# EAGLE schematic introAu (EAGLE 7.3.0)
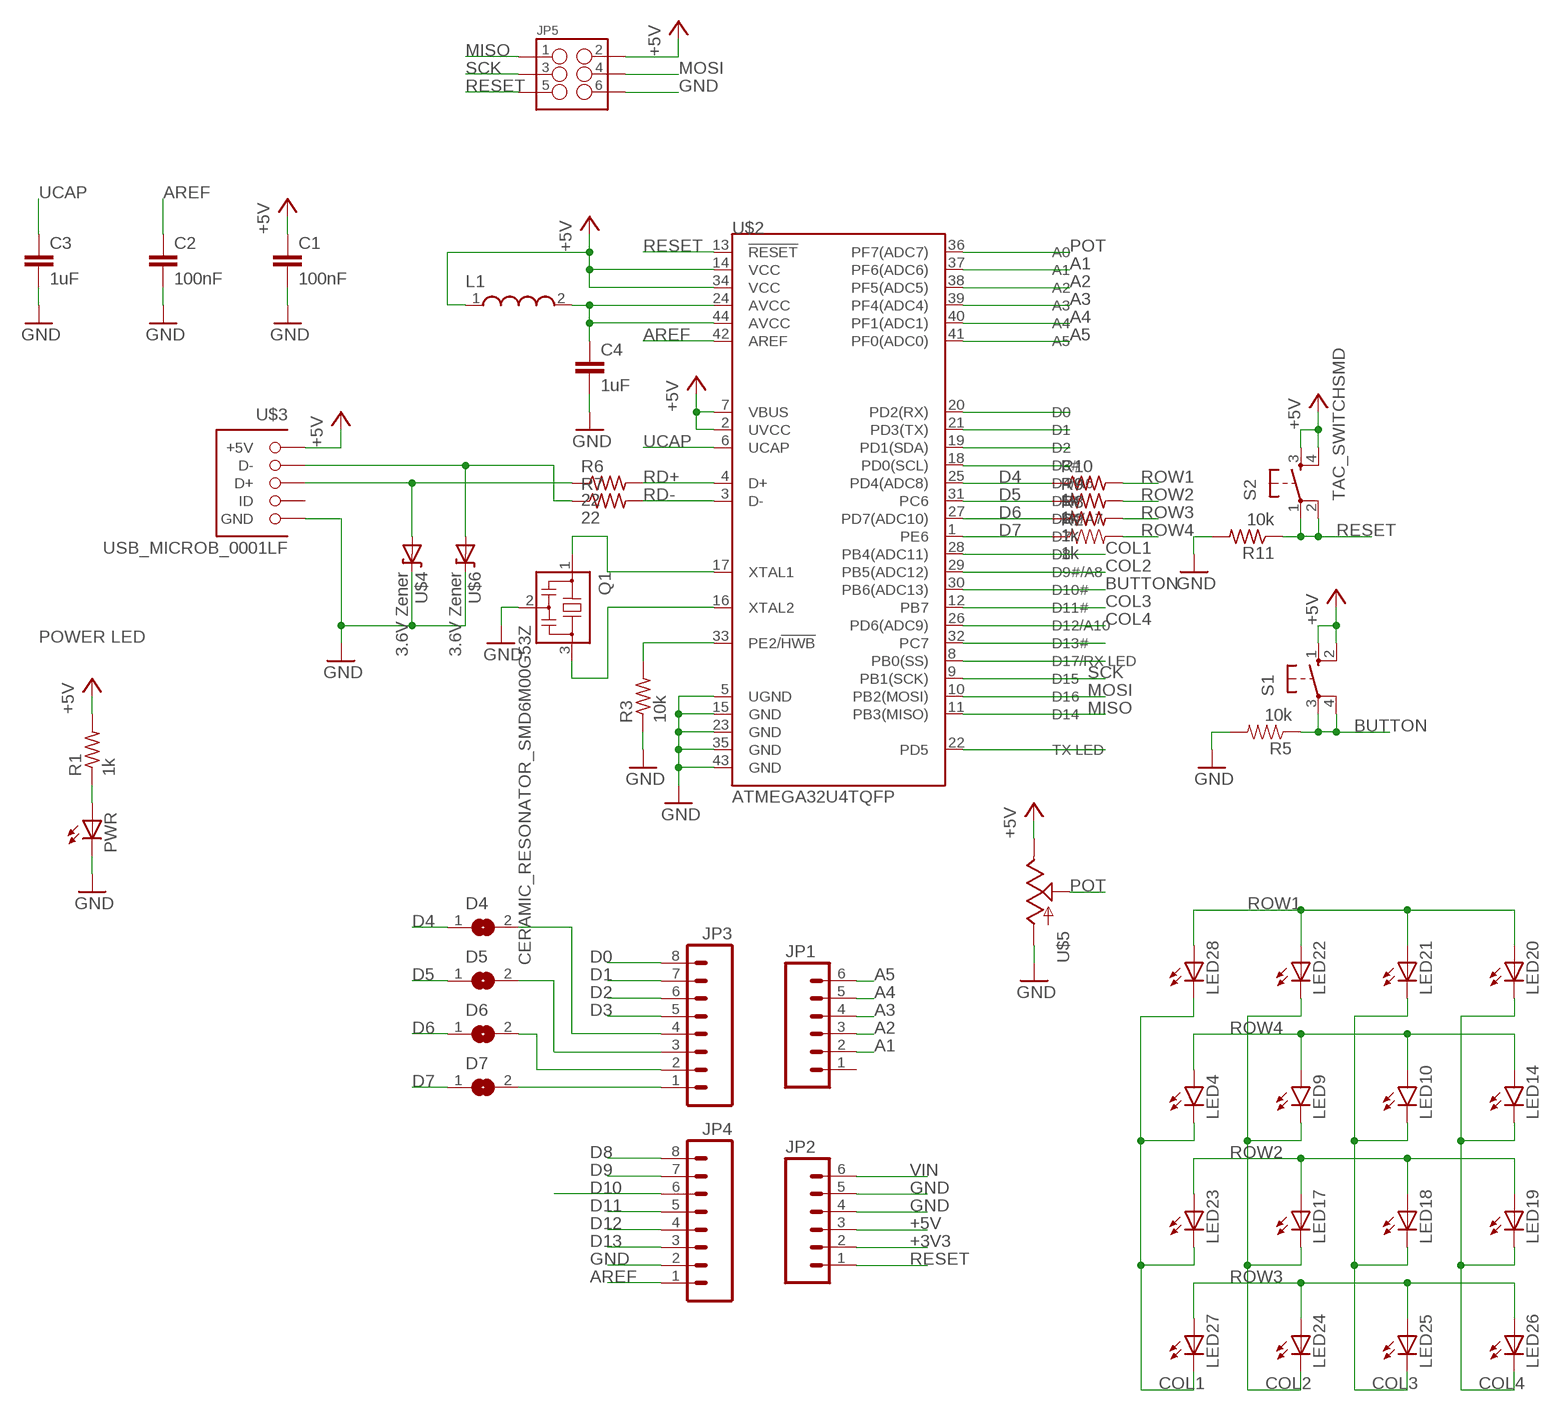
[diagram p0: schematic, sheet 1]

## Parts
C1  100nF  C-EUC0805  [C0805]
C2  100nF  C-EUC0805  [C0805]
C3  1uF  C-EUC0805  [C0805]
C4  1uF  C-EUC0805  [C0805]
D4  SJ  [SJ]
D5  SJ  [SJ]
D6  SJ  [SJ]
D7  SJ  [SJ]
JP1  M06SMD-STRAIGHT-COMBO  [1X06_SMD_STRAIGHT_COMBO]
JP2  M06SMD-STRAIGHT-COMBO  [1X06_SMD_STRAIGHT_COMBO]
JP3  M08SMD-COMBO  [1X08_SMD_COMBINED]
JP4  M08SMD-COMBO  [1X08_SMD_COMBINED]
JP5  M03X22X3_SILK_SM  [2X3]
L1  WE-CBF_0805(WB/HS)  [WE-CBF_0805(W=3.0)]
LED4  LED5MM  [LED5MM]
LED9  LED5MM  [LED5MM]
LED10  LED5MM  [LED5MM]
LED14  LED5MM  [LED5MM]
LED17  LEDCHIPLED_0805  [CHIPLED_0805]
LED18  LEDCHIPLED_0805  [CHIPLED_0805]
LED19  LEDCHIPLED_0805  [CHIPLED_0805]
LED20  LEDCHIPLED_0805  [CHIPLED_0805]
LED21  LEDCHIPLED_0805  [CHIPLED_0805]
LED22  LEDCHIPLED_0805  [CHIPLED_0805]
LED23  LEDCHIPLED_0805  [CHIPLED_0805]
LED24  LEDCHIPLED_0805  [CHIPLED_0805]
LED25  LEDCHIPLED_0805  [CHIPLED_0805]
LED26  LEDCHIPLED_0805  [CHIPLED_0805]
LED27  LEDCHIPLED_0805  [CHIPLED_0805]
LED28  LEDCHIPLED_0805  [CHIPLED_0805]
PWR  LEDCHIPLED_0805  [CHIPLED_0805]
Q1  CERAMIC_RESONATOR_SMD6M00G53Z  [CERAMIC_RESONATOR_SMD]
R1  1k  R-US_R0805  [R0805]
R2  1k  1KOHM1/4W5%(PTH)HORIZ-KIT  [AXIAL-0.3EZ]
R3  10k  R-US_R0805  [R0805]
R5  10k  1KOHM1/4W5%(PTH)HORIZ-KIT  [AXIAL-0.3EZ]
R6  22  R-US_R0805  [R0805]
R7  22  R-US_R0805  [R0805]
R8  1k  R-US_R0805  [R0805]
R9  1k  R-US_R0805  [R0805]
R10  1k  R-US_R0805  [R0805]
R11  10k  R-US_R0805  [R0805]
S1  TACT_BUTTON  [B3F-10XX]
S2  TAC_SWITCHSMD  [TACTILE-SWITCH-SMD]
U$2  ATMEGA32U4TQFP  [SPARKFUN-DIGITALIC_TQFP44]
U$3  USB_MICROB_0001LF  [USB_MICROB_CHEAPER]
U$4  3.6V Zener  DIODE-ZENER-BZT52  [SOD-323]
U$5  POT  [ALPS_POT]
U$6  3.6V Zener  DIODE-ZENER-BZT52  [SOD-323]

## Nets
+3V3: JP2.2
+5V: C1.1 JP2.3 JP5.2 L1.1 R1.2 S1.1(S) S1.2(S1) S2.3 S2.4 U$2.2(UVCC) U$2.7(VBUS) U$2.14(VCC) U$2.34(VCC) U$3.P$1(+5V) U$5.P$1(E)
A1: JP1.2 U$2.37(PF6(ADC6))
A2: JP1.3 U$2.38(PF5(ADC5))
A3: JP1.4 U$2.39(PF4(ADC4))
A4: JP1.5 U$2.40(PF1(ADC1))
A5: JP1.6 U$2.41(PF0(ADC0))
AREF: C2.1 JP4.1 U$2.42(AREF)
BUTTON: R5.P$1 S1.3(P) S1.4(P1) U$2.30(PB6(ADC13))
COL1: LED4.K(C) LED23.C LED27.C LED28.C U$2.28(PB4(ADC11))
COL2: LED9.K(C) LED17.C LED22.C LED24.C U$2.29(PB5(ADC12))
COL3: LED10.K(C) LED18.C LED21.C LED25.C U$2.12(PB7)
COL4: LED14.K(C) LED19.C LED20.C LED26.C U$2.26(PD6(ADC9))
D0: JP3.8 U$2.20(PD2(RX))
D1: JP3.7 U$2.21(PD3(TX))
D2: JP3.6 U$2.19(PD1(SDA))
D3: JP3.5 U$2.18(PD0(SCL))
D4: D4.1 R10.1 U$2.25(PD4(ADC8))
D5: D5.1 R9.1 U$2.31(PC6)
D6: D6.1 R8.1 U$2.27(PD7(ADC10))
D7: D7.1 R2.P$1 U$2.1(PE6)
D8: JP4.8
D9: JP4.7
D10: JP4.6
D11: JP4.5
D12: JP4.4
D13: JP4.3 U$2.32(PC7)
D17: U$2.8(PB0(SS))
GND: C1.2 C2.2 C3.2 C4.2 JP2.4 JP2.5 JP4.2 JP5.6 PWR.C Q1.2 R3.1 R5.P$2 R11.2 U$2.5(UGND) U$2.15(GND) U$2.23(GND) U$2.35(GND) U$2.43(GND) U$3.P$4(GND) U$4.1(C) U$5.P$3(A) U$6.1(C)
MISO: JP5.1 U$2.11(PB3(MISO))
MOSI: JP5.4 U$2.10(PB2(MOSI))
N$5: Q1.3 U$2.16(XTAL2)
N$6: Q1.1 U$2.17(XTAL1)
N$7: R7.1 U$3.P$2(D-) U$6.2(A)
N$8: R3.2 U$2.33(PE2/!HWB)
N$9: R6.1 U$3.P$3(D+) U$4.2(A)
N$10: C4.1 L1.2 U$2.24(AVCC) U$2.44(AVCC)
N$11: PWR.A R1.1
N$12: D7.2 JP3.1
N$15: D5.2 JP3.3
N$16: D6.2 JP3.2
N$17: D4.2 JP3.4
POT: U$2.36(PF7(ADC7)) U$5.P$2(S)
RD+: R6.2 U$2.4(D+)
RD-: R7.2 U$2.3(D-)
RESET: JP2.1 JP5.5 R11.1 S2.1 S2.2 U$2.13(!RESET)
ROW1: LED20.A LED21.A LED22.A LED28.A R10.2
ROW2: LED17.A LED18.A LED19.A LED23.A R9.2
ROW3: LED24.A LED25.A LED26.A LED27.A R8.2
ROW4: LED4.A LED9.A LED10.A LED14.A R2.P$2
SCK: JP5.3 U$2.9(PB1(SCK))
TX: U$2.22(PD5)
UCAP: C3.1 U$2.6(UCAP)
VIN: JP2.6
Unconnected: JP1.1 U$3.P$5(ID)

## Notes on the sheet
- POWER LED

## Library data of the parts
C1-C4 = rcl:C-EU: CAPACITOR, European symbol
D4-D7 = jumper:SJ: SMD solder JUMPER
JP1 JP2 = SparkFun-Connectors:M06: Header 6 Standard 6-pin 0.1" header. Use with straight break away headers (SKU : PRT-00116), right angle break away headers (PRT-00553), swiss pins (PRT-00743), machine pins (PRT-00117), and female headers (PRT-00115). Molex polarized connector foot print use with SKU : PRT-08094 with associated crimp pins and housings. NOTES ON THE VARIANTS LOCK and LOCK_LONGPADS... This footprint was designed to help hold the alignment of a through-hole component (i.e. 6-pin header) while soldering it into place. You may notice that each hole has been shifted either up or down by 0.005 of an inch from it's more standard position (which is a perfectly straight line). This slight alteration caused the pins (the squares in the middle) to touch the edges of the holes. Because they are alternating, it causes a "brace" to hold the component in place. 0.005 has proven to be the perfect amount of "off-center" position when using our standard breakaway headers. Although looks a little odd when you look at the bare footprint, once you have a header in there, the alteration is very hard to notice. Also,if you push a header all the way into place, it is covered up entirely on the bottom side. This idea of altering the position of holes to aid alignment will be further integrated into the Sparkfun Library for other footprints. It can help hold any component with 3 or more connection pins.
JP3 JP4 = SparkFun-Connectors:M08: Header 8 Standard 8-pin 0.1" header. Use with straight break away headers (SKU : PRT-00116), right angle break away headers (PRT-00553), swiss pins (PRT-00743), machine pins (PRT-00117), and female headers (PRT-00115).
JP5 = SparkFun-Connectors:M03X2: 2x3 .1" header. Shrouded, with keying- CONN-10681 SMT- CONN-11415 Pogo pins- HW-11044
L1 = EagleLibrary_Wuerth_Elektronik_eiSos_rev15c:WE-CBF: WE-CBF SMD EMI Suppression Ferrite Bead Characteristics Reliable Ni-Sn electrodes High rated current up to 6 A Operating temperature: –55 ºC to +125 ºC Applications Perfect as data lined filter and for uncoupling of distribution voltage Variant abbreviation WB means WIDE BAND HS means HIGH SPEED HC means HIGH CURRENT <http://katalog.we-online.de/media/images/eisos/FeCBF_pf2.jpg> Details see: http://katalog.we-online.de/en/pbs/WE-CBF Updated on 2014-06-19 2014 (C) Wurth Elektronik
LED4 LED9 LED10 LED14 = SparkFun-LED:LED: LEDs Standard schematic elements and footprints for 5mm, 3mm, 1206, and 0603 sized LEDs. 5mm - Spark Fun Electronics SKU : COM-00529 (and others)
LED17-LED28 PWR = led:LED: LED OSRAM: - CHIPLED LG R971, LG N971, LY N971, LG Q971, LY Q971, LO R971, LY R971 LH N974, LH R974 LS Q976, LO Q976, LY Q976 LO Q996 - Hyper CHIPLED LW Q18S LB Q993, LB Q99A, LB R99A - SideLED LS A670, LO A670, LY A670, LG A670, LP A670 LB A673, LV A673, LT A673, LW A673 LH A674 LY A675 LS A676, LA A676, LO A676, LY A676, LW A676 LS A679, LY A679, LG A679 - Hyper Micro SIDELED® LS Y876, LA Y876, LO Y876, LY Y876 LT Y87S - SmartLED LW L88C, LW L88S LB L89C, LB L89S, LG L890 LS L89K, LO L89K, LY L89K LS L896, LA L896, LO L896, LY L896 - TOPLED LS T670, LO T670, LY T670, LG T670, LP T670 LSG T670, LSP T670, LSY T670, LOP T670, LYG T670 LG T671, LOG T671, LSG T671 LB T673, LV T673, LT T673, LW T673 LH T674 LS T676, LA T676, LO T676, LY T676, LB T676, LH T676, LSB T676, LW T676 LB T67C, LV T67C, LT T67C, LS T67K, LO T67K, LY T67K, LW E67C LS E67B, LA E67B, LO E67B, LY E67B, LB E67C, LV E67C, LT E67C LW T67C LS T679, LY T679, LG T679 LS T770, LO T770, LY T770, LG T770, LP T770 LB T773, LV T773, LT T773, LW T773 LH T774 LS E675, LA E675, LY E675, LS T675 LS T776, LA T776, LO T776, LY T776, LB T776 LHGB T686 LT T68C, LB T68C - Hyper Mini TOPLED® LB M676 - Mini TOPLED Santana® LG M470 LS M47K, LO M47K, LY M47K Source: http://www.osram.convergy.de LUXEON: - LUMILED® LXK2-PW12-R00, LXK2-PW12-S00, LXK2-PW14-U00, LXK2-PW14-V00 LXK2-PM12-R00, LXK2-PM12-S00, LXK2-PM14-U00 LXK2-PE12-Q00, LXK2-PE12-R00, LXK2-PE12-S00, LXK2-PE14-T00, LXK2-PE14-U00 LXK2-PB12-K00, LXK2-PB12-L00, LXK2-PB12-M00, LXK2-PB14-N00, LXK2-PB14-P00, LXK2-PB14-Q00 LXK2-PR12-L00, LXK2-PR12-M00, LXK2-PR14-Q00, LXK2-PR14-R00 LXK2-PD12-Q00, LXK2-PD12-R00, LXK2-PD12-S00 LXK2-PH12-R00, LXK2-PH12-S00 LXK2-PL12-P00, LXK2-PL12-Q00, LXK2-PL12-R00 Source: www.luxeon.com KINGBRIGHT: KA-3528ASYC Source: www.kingbright.com
Q1 = MESH_Arduino:CERAMIC_RESONATOR_SMD: Resonator Source: murata.co.jp; MPN: CSTCR6M00G53-R0; OC_FARNELL: 1170434; OC_NEWARK: 25M8759
R1 R3 R6-R11 = rcl:R-US_: RESISTOR, American symbol
R2 = SparkFun-Resistors:1KOHM1/4W5%(PTH): RES-08380; PROD_ID: RES-08380
R5 = SparkFun-Resistors:1KOHM1/4W5%(PTH): RES-08380; PROD_ID: RES-08380; VALUE: 1k
S1 = MESH_Arduino:TACT_BUTTON: OMRON SWITCH; MPN: B3F-1000; OC_FARNELL: 176432; OC_NEWARK: 36M3542
S2 = mBLE:TAC_SWITCH: Momentary Switch Button commonly used for reset or general input. Spark Fun Electronics SKU : COM-00097 SMT- SWCH-08247; PROD_ID: SWCH-08247
U$2 = SparkFun-DigitalIC:ATMEGA32U4: Atmel 44-pin 8-bit Microcontroller with 32KBytes of ISP Flash and USB Controller ----- Please use the QFN-44-NOPAD_1:1 package for the footprint of all boards using a 32U4. Route traces directly away from the pads as much as possible.
U$3 = mBLE:USB_MICROB_0001LF
U$4 U$6 = SparkFun-DiscreteSemi:DIODE-ZENER: Zener Diode Production Part - 8199 3.4V Zener Voltage
U$5 = SparkFun-Electromechanical:POT